# Altium project GBit_Eth.PrjPcb
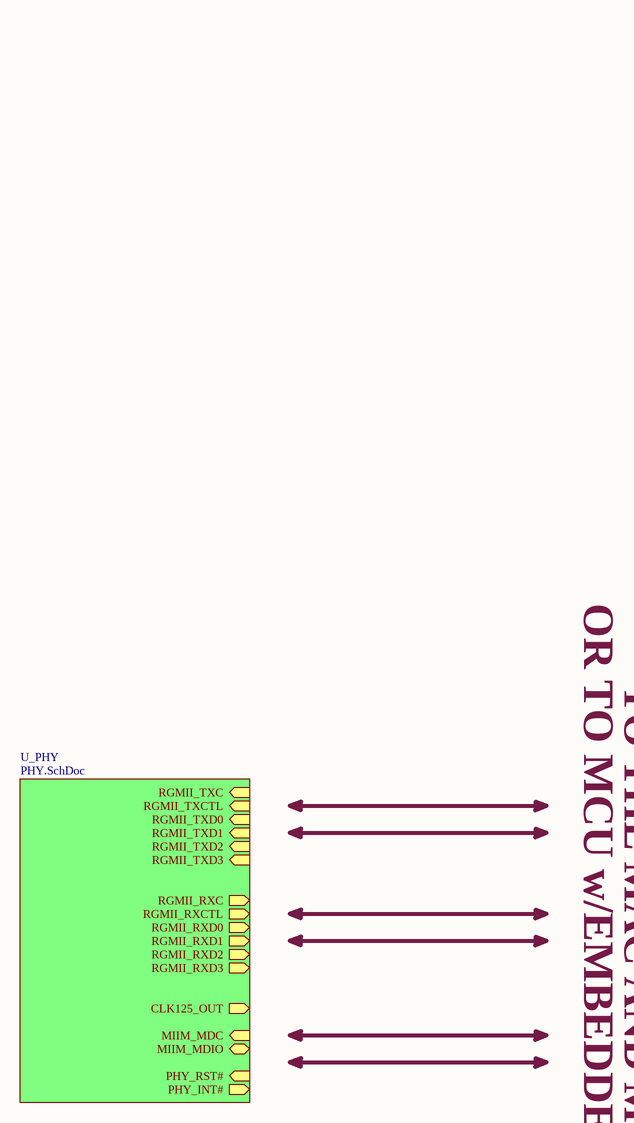
[diagram p0: TOP.SchDoc]
3 sheets, 92 parts. Net scope: hierarchical (ports join the sheet entries above them; power ports are global).
Sheets:
  TOP.SchDoc
    U_PHY = PHY.SchDoc
      U_Magnetics = Magnetics.SchDoc

## Sheet TOP.SchDoc
size A4

### Sub-sheets
U_PHY = PHY.SchDoc: RGMII_RXC (out), RGMII_RXCTL (out), RGMII_RXD0 (out), RGMII_RXD1 (out), RGMII_RXD2 (out), RGMII_RXD3 (out), CLK125_OUT (out), RGMII_TXC (in), RGMII_TXCTL (in), RGMII_TXD0 (in), RGMII_TXD1 (in), RGMII_TXD2 (in), RGMII_TXD3 (in), MIIM_MDC (in), MIIM_MDIO (bidir), PHY_RST# (in), PHY_INT# (out)

### Notes on the sheet
- OR TO MCU w/EMBEDDED MAC
- TO THE MAC AND MCU

## Sheet PHY.SchDoc
size A3
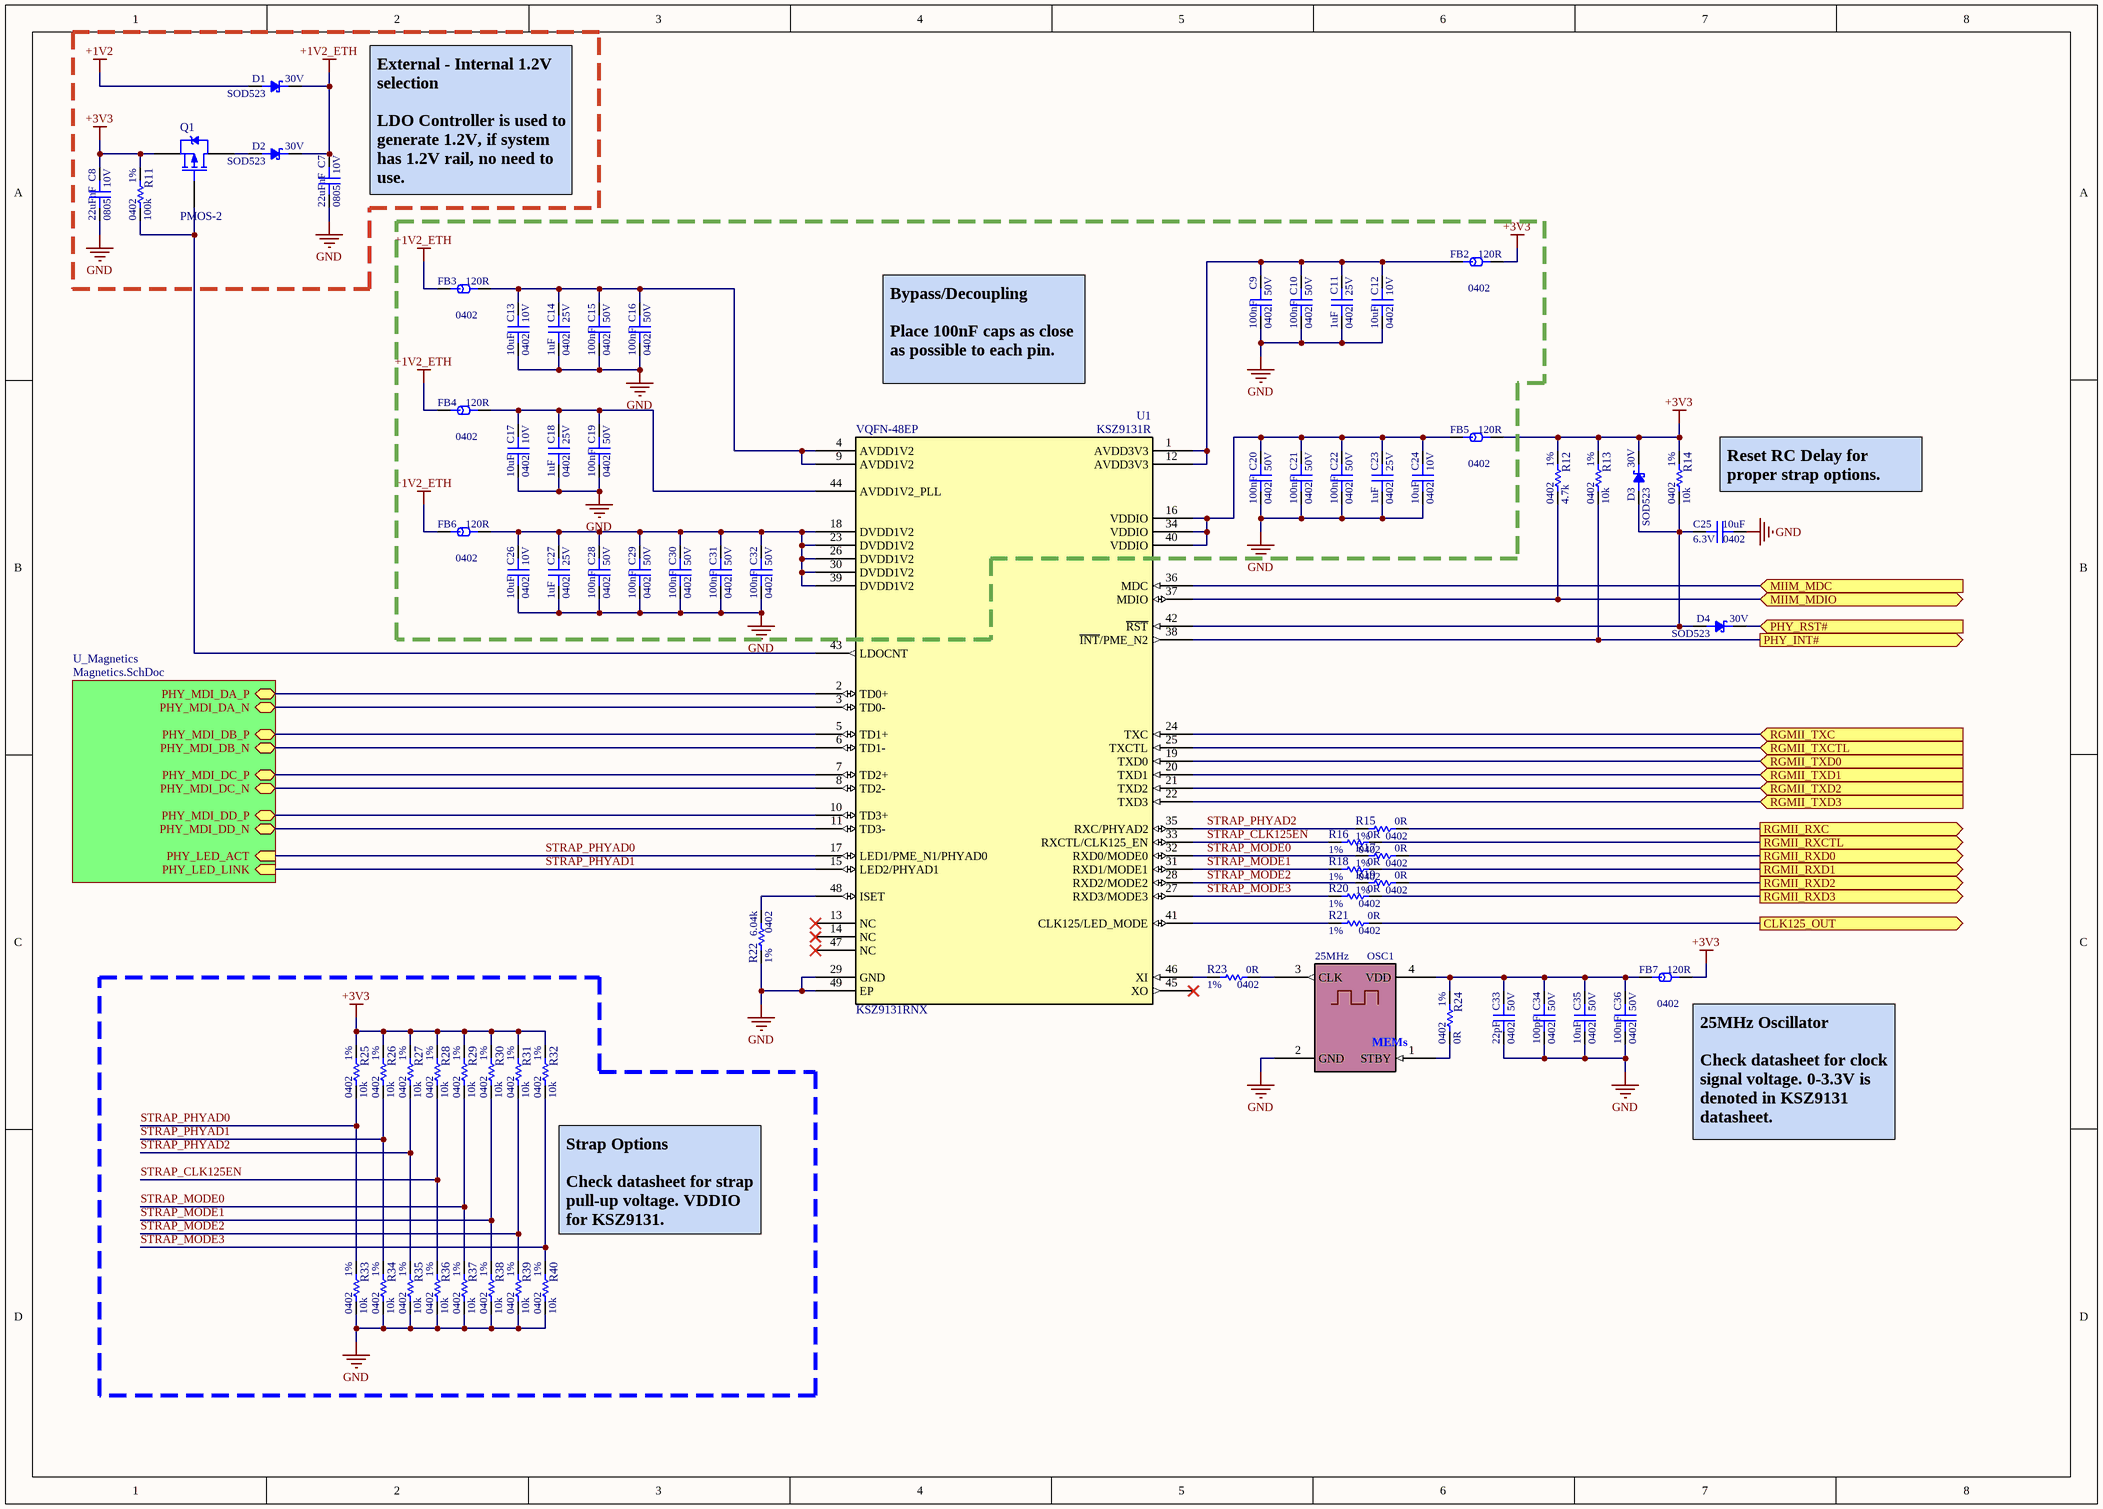
[diagram p1: PHY.SchDoc]

### Parts
C7  value 22uFnF  Voltage: 10V  Package: 0805  [C_0402_GEN_0.70H]  (hidden comment: Capacitor)
C8  value 22uFnF  Voltage: 10V  Package: 0805  [C_0402_GEN_0.70H]  (hidden comment: Capacitor)
C9  value 100nF  Voltage: 50V  Package: 0402  [C_0402_GEN_0.70H]  (hidden comment: Capacitor)
C10  value 100nF  Voltage: 50V  Package: 0402  [C_0402_GEN_0.70H]  (hidden comment: Capacitor)
C11  value 1uF  Voltage: 25V  Package: 0402  [C_0402_GEN_0.70H]  (hidden comment: Capacitor)
C12  value 10uF  Voltage: 10V  Package: 0402  [C_0402_GEN_0.70H]  (hidden comment: Capacitor)
C13  value 10uF  Voltage: 10V  Package: 0402  [C_0402_GEN_0.70H]  (hidden comment: Capacitor)
C14  value 1uF  Voltage: 25V  Package: 0402  [C_0402_GEN_0.70H]  (hidden comment: Capacitor)
C15  value 100nF  Voltage: 50V  Package: 0402  [C_0402_GEN_0.70H]  (hidden comment: Capacitor)
C16  value 100nF  Voltage: 50V  Package: 0402  [C_0402_GEN_0.70H]  (hidden comment: Capacitor)
C17  value 10uF  Voltage: 10V  Package: 0402  [C_0402_GEN_0.70H]  (hidden comment: Capacitor)
C18  value 1uF  Voltage: 25V  Package: 0402  [C_0402_GEN_0.70H]  (hidden comment: Capacitor)
C19  value 100nF  Voltage: 50V  Package: 0402  [C_0402_GEN_0.70H]  (hidden comment: Capacitor)
C20  value 100nF  Voltage: 50V  Package: 0402  [C_0402_GEN_0.70H]  (hidden comment: Capacitor)
C21  value 100nF  Voltage: 50V  Package: 0402  [C_0402_GEN_0.70H]  (hidden comment: Capacitor)
C22  value 100nF  Voltage: 50V  Package: 0402  [C_0402_GEN_0.70H]  (hidden comment: Capacitor)
C23  value 1uF  Voltage: 25V  Package: 0402  [C_0402_GEN_0.70H]  (hidden comment: Capacitor)
C24  value 10uF  Voltage: 10V  Package: 0402  [C_0402_GEN_0.70H]  (hidden comment: Capacitor)
C25  value 10uF  Voltage: 6.3V  Package: 0402  [C_0402_MED-N_0.70H]  (hidden comment: Capacitor)
C26  value 10uF  Voltage: 10V  Package: 0402  [C_0402_GEN_0.70H]  (hidden comment: Capacitor)
C27  value 1uF  Voltage: 25V  Package: 0402  [C_0402_GEN_0.70H]  (hidden comment: Capacitor)
C28  value 100nF  Voltage: 50V  Package: 0402  [C_0402_GEN_0.70H]  (hidden comment: Capacitor)
C29  value 100nF  Voltage: 50V  Package: 0402  [C_0402_GEN_0.70H]  (hidden comment: Capacitor)
C30  value 100nF  Voltage: 50V  Package: 0402  [C_0402_GEN_0.70H]  (hidden comment: Capacitor)
C31  value 100nF  Voltage: 50V  Package: 0402  [C_0402_GEN_0.70H]  (hidden comment: Capacitor)
C32  value 100nF  Voltage: 50V  Package: 0402  [C_0402_GEN_0.70H]  (hidden comment: Capacitor)
C33  value 22pF  Voltage: 50V  Package: 0402  [C_0402_GEN_0.70H]  (hidden comment: Capacitor)
C34  value 100pF  Voltage: 50V  Package: 0402  [C_0402_GEN_0.70H]  (hidden comment: Capacitor)
C35  value 10nF  Voltage: 50V  Package: 0402  [C_0402_GEN_0.70H]  (hidden comment: Capacitor)
C36  value 100nF  Voltage: 50V  Package: 0402  [C_0402_GEN_0.70H]  (hidden comment: Capacitor)
D1  Voltage: 30V  Package: SOD523  [SOD523_RB530SM-30T2R]  (hidden comment: SchDiode_A1C2)
D2  Voltage: 30V  Package: SOD523  [SOD523_RB530SM-30T2R]  (hidden comment: SchDiode_A1C2)
D3  Voltage: 30V  Package: SOD523  [SOD523_RB530SM-30T2R]  (hidden comment: SchDiode_A1C2)
D4  Voltage: 30V  Package: SOD523  [SOD523_RB530SM-30T2R]  (hidden comment: SchDiode_A1C2)
FB2  value 120R  Package: 0402  [FB_0402_GEN_0.55h]  (hidden comment: FerriteBead)
FB3  value 120R  Package: 0402  [FB_0402_GEN_0.55h]  (hidden comment: FerriteBead)
FB4  value 120R  Package: 0402  [FB_0402_GEN_0.55h]  (hidden comment: FerriteBead)
FB5  value 120R  Package: 0402  [FB_0402_GEN_0.55h]  (hidden comment: FerriteBead)
FB6  value 120R  Package: 0402  [FB_0402_GEN_0.55h]  (hidden comment: FerriteBead)
FB7  value 120R  Package: 0402  [FB_0402_GEN_0.55h]  (hidden comment: FerriteBead)
OSC1  value 25MHz  [SMD_3.2X2.5X0.9_ASEMB-25.000MHZ-LY-T]  (hidden comment: Oscillator_4Pin)
Q1  PMOS-2  [TO-220AB]
R11  value 100k  Tolerance: 1%  Package: 0402  [R_0402_GEN_0.40H]  (hidden comment: StandardResistor)
R12  value 4.7k  Tolerance: 1%  Package: 0402  [R_0402_GEN_0.40H]  (hidden comment: StandardResistor)
R13  value 10k  Tolerance: 1%  Package: 0402  [R_0402_GEN_0.40H]  (hidden comment: StandardResistor)
R14  value 10k  Tolerance: 1%  Package: 0402  [R_0402_GEN_0.40H]  (hidden comment: StandardResistor)
R15  value 0R  Tolerance: 1%  Package: 0402  [R_0402_GEN_0.40H]  (hidden comment: StandardResistor)
R16  value 0R  Tolerance: 1%  Package: 0402  [R_0402_GEN_0.40H]  (hidden comment: StandardResistor)
R17  value 0R  Tolerance: 1%  Package: 0402  [R_0402_GEN_0.40H]  (hidden comment: StandardResistor)
R18  value 0R  Tolerance: 1%  Package: 0402  [R_0402_GEN_0.40H]  (hidden comment: StandardResistor)
R19  value 0R  Tolerance: 1%  Package: 0402  [R_0402_GEN_0.40H]  (hidden comment: StandardResistor)
R20  value 0R  Tolerance: 1%  Package: 0402  [R_0402_GEN_0.40H]  (hidden comment: StandardResistor)
R21  value 0R  Tolerance: 1%  Package: 0402  [R_0402_GEN_0.40H]  (hidden comment: StandardResistor)
R22  value 6.04k  Tolerance: 1%  Package: 0402  [R_0402_GEN_0.40H]  (hidden comment: StandardResistor)
R23  value 0R  Tolerance: 1%  Package: 0402  [R_0402_GEN_0.40H]  (hidden comment: StandardResistor)
R24  value 0R  Tolerance: 1%  Package: 0402  [R_0402_GEN_0.40H]  (hidden comment: StandardResistor)
R25  value 10k  Tolerance: 1%  Package: 0402  [R_0402_GEN_0.40H]  (hidden comment: StandardResistor)
R26  value 10k  Tolerance: 1%  Package: 0402  [R_0402_GEN_0.40H]  (hidden comment: StandardResistor)
R27  value 10k  Tolerance: 1%  Package: 0402  [R_0402_GEN_0.40H]  (hidden comment: StandardResistor)
R28  value 10k  Tolerance: 1%  Package: 0402  [R_0402_GEN_0.40H]  (hidden comment: StandardResistor)
R29  value 10k  Tolerance: 1%  Package: 0402  [R_0402_GEN_0.40H]  (hidden comment: StandardResistor)
R30  value 10k  Tolerance: 1%  Package: 0402  [R_0402_GEN_0.40H]  (hidden comment: StandardResistor)
R31  value 10k  Tolerance: 1%  Package: 0402  [R_0402_GEN_0.40H]  (hidden comment: StandardResistor)
R32  value 10k  Tolerance: 1%  Package: 0402  [R_0402_GEN_0.40H]  (hidden comment: StandardResistor)
R33  value 10k  Tolerance: 1%  Package: 0402  [R_0402_GEN_0.40H]  (hidden comment: StandardResistor)
R34  value 10k  Tolerance: 1%  Package: 0402  [R_0402_GEN_0.40H]  (hidden comment: StandardResistor)
R35  value 10k  Tolerance: 1%  Package: 0402  [R_0402_GEN_0.40H]  (hidden comment: StandardResistor)
R36  value 10k  Tolerance: 1%  Package: 0402  [R_0402_GEN_0.40H]  (hidden comment: StandardResistor)
R37  value 10k  Tolerance: 1%  Package: 0402  [R_0402_GEN_0.40H]  (hidden comment: StandardResistor)
R38  value 10k  Tolerance: 1%  Package: 0402  [R_0402_GEN_0.40H]  (hidden comment: StandardResistor)
R39  value 10k  Tolerance: 1%  Package: 0402  [R_0402_GEN_0.40H]  (hidden comment: StandardResistor)
R40  value 10k  Tolerance: 1%  Package: 0402  [R_0402_GEN_0.40H]  (hidden comment: StandardResistor)
U1  KSZ9131RNX  value KSZ9131R  Package: VQFN-48EP

### Sub-sheets
U_Magnetics = Magnetics.SchDoc: PHY_MDI_DA_P (bidir), PHY_MDI_DA_N (bidir), PHY_MDI_DB_P (bidir), PHY_MDI_DB_N (bidir), PHY_MDI_DC_P (bidir), PHY_MDI_DC_N (bidir), PHY_MDI_DD_P (bidir), PHY_MDI_DD_N (bidir), PHY_LED_ACT (in), PHY_LED_LINK (in)

### Ports
CLK125_OUT (out), MIIM_MDC (in), MIIM_MDIO (bidir), PHY_INT# (out), PHY_RST# (in), RGMII_RXC (out), RGMII_RXCTL (out), RGMII_RXD0 (out), RGMII_RXD1 (out), RGMII_RXD2 (out), RGMII_RXD3 (out), RGMII_TXC (in), RGMII_TXCTL (in), RGMII_TXD0 (in), RGMII_TXD1 (in), RGMII_TXD2 (in), RGMII_TXD3 (in)

### Nets
+1V2: D1.1(A)
+1V2_ETH: C7.1 D1.2(C) D2.2(C) FB3.1 FB4.1 FB6.1
+3V3: C8.1 D3.2(C) FB2.2 FB5.2 FB7.2 Q1.3(S) R11.1 R12.1 R13.1 R14.1 R25.1 R26.1 R27.1 R28.1 R29.1 R30.1 R31.1 R32.1
GND: C7.2 C8.2 C9.2 C10.2 C11.2 C12.2 C13.2 C14.2 C15.2 C16.2 C17.2 C18.2 C19.2 C20.2 C21.2 C22.2 C23.2 C24.2 C25.2 C26.2 C27.2 C28.2 C29.2 C30.2 C31.2 C32.2 C33.2 C34.2 C35.2 C36.2 OSC1.2(GND) R22.1 R33.2 R34.2 R35.2 R36.2 R37.2 R38.2 R39.2 R40.2 U1.29(GND) U1.49(EP)
PHY_MDI_DA_N: U1.3(TD0-) ; sheet U_Magnetics/PHY_MDI_DA_N
PHY_MDI_DA_P: U1.2(TD0+) ; sheet U_Magnetics/PHY_MDI_DA_P
PHY_MDI_DB_N: U1.6(TD1-) ; sheet U_Magnetics/PHY_MDI_DB_N
PHY_MDI_DB_P: U1.5(TD1+) ; sheet U_Magnetics/PHY_MDI_DB_P
PHY_MDI_DC_N: U1.8(TD2-) ; sheet U_Magnetics/PHY_MDI_DC_N
PHY_MDI_DC_P: U1.7(TD2+) ; sheet U_Magnetics/PHY_MDI_DC_P
PHY_MDI_DD_N: U1.11(TD3-) ; sheet U_Magnetics/PHY_MDI_DD_N
PHY_MDI_DD_P: U1.10(TD3+) ; sheet U_Magnetics/PHY_MDI_DD_P
STRAP_CLK125EN: R16.1 R28.2 R36.1 U1.33(RXCTL/CLK125_EN)
STRAP_MODE0: R17.1 R29.2 R37.1 U1.32(RXD0/MODE0)
STRAP_MODE1: R18.1 R30.2 R38.1 U1.31(RXD1/MODE1)
STRAP_MODE2: R19.1 R31.2 R39.1 U1.28(RXD2/MODE2)
STRAP_MODE3: R20.1 R32.2 R40.1 U1.27(RXD3/MODE3)
STRAP_PHYAD0: R25.2 R33.1 U1.17(LED1/PME_N1/PHYAD0) ; sheet U_Magnetics/PHY_LED_ACT
STRAP_PHYAD1: R26.2 R34.1 U1.15(LED2/PHYAD1) ; sheet U_Magnetics/PHY_LED_LINK
STRAP_PHYAD2: R15.1 R27.2 R35.1 U1.35(RXC/PHYAD2)
NetC9_1: C9.1 C10.1 C11.1 C12.1 FB2.1 U1.1(AVDD3V3) U1.12(AVDD3V3)
NetC13_1: C13.1 C14.1 C15.1 C16.1 FB3.2 U1.4(AVDD1V2) U1.9(AVDD1V2)
NetC17_1: C17.1 C18.1 C19.1 FB4.2 U1.44(AVDD1V2_PLL)
NetC20_1: C20.1 C21.1 C22.1 C23.1 C24.1 FB5.1 U1.16(VDDIO) U1.34(VDDIO) U1.40(VDDIO)
NetC25_1: C25.1 D3.1(A) D4.1(A) R14.2 U1.42(~{RST})
NetC26_1: C26.1 C27.1 C28.1 C29.1 C30.1 C31.1 C32.1 FB6.2 U1.18(DVDD1V2) U1.23(DVDD1V2) U1.26(DVDD1V2) U1.30(DVDD1V2) U1.39(DVDD1V2)
NetC33_1: C33.1 C34.1 C35.1 C36.1 FB7.1 OSC1.4(VDD) R24.1
NetD2_1: D2.1(A) Q1.2(D)
NetD4_2: D4.2(C) ; port PHY_RST#
NetOSC1_1: OSC1.1(STBY) R24.2
NetOSC1_3: OSC1.3(CLK) R23.2
NetQ1_1: Q1.1(G) R11.2 U1.43(LDOCNT)
NetR12_2: R12.2 U1.37(MDIO) ; port MIIM_MDIO
NetR13_2: R13.2 U1.38(~{INT}/PME_N2) ; port PHY_INT#
NetR15_2: R15.2 ; port RGMII_RXC
NetR16_2: R16.2 ; port RGMII_RXCTL
NetR17_2: R17.2 ; port RGMII_RXD0
NetR18_2: R18.2 ; port RGMII_RXD1
NetR19_2: R19.2 ; port RGMII_RXD2
NetR20_2: R20.2 ; port RGMII_RXD3
NetR21_1: R21.1 U1.41(CLK125/LED_MODE)
NetR21_2: R21.2 ; port CLK125_OUT
NetR22_2: R22.2 U1.48(ISET)
NetR23_1: R23.1 U1.46(XI)
NetU1_19: U1.19(TXD0) ; port RGMII_TXD0
NetU1_20: U1.20(TXD1) ; port RGMII_TXD1
NetU1_21: U1.21(TXD2) ; port RGMII_TXD2
NetU1_22: U1.22(TXD3) ; port RGMII_TXD3
NetU1_24: U1.24(TXC) ; port RGMII_TXC
NetU1_25: U1.25(TXCTL) ; port RGMII_TXCTL
NetU1_36: U1.36(MDC) ; port MIIM_MDC

Not connected (* = marked no-connect by the designer): U1 13(NC)* 14(NC)* 45(XO)* 47(NC)*

### Notes on the sheet
- (near C7) External - Internal 1.2V selection
  LDO Controller is used to generate 1.2V, if system has 1.2V rail, no need to use.
- Bypass/Decoupling
  Place 100nF caps as close as possible to each pin.
- Reset RC Delay for proper strap options.
- (near FB7) 25MHz Oscillator
  Check datasheet for clock signal voltage. 0-3.3V is denoted in KSZ9131 datasheet.
- Strap Options
  Check datasheet for strap pull-up voltage. VDDIO for KSZ9131.
- (in symbol XO_25MHZ_#1) MEMs

### Library data of the parts
C7-C24 C26-C32 C36 = CER_100nF_#5: CAP_CER_100nF_50V_X7R_10%_0402; Tolerance: 10%; Identifier: CER_100nF_#5
C25 = CER_10uF_#7: CAP_CER_10uF_6.3V_X5R_20%_0402; Tolerance: 20%; Identifier: CER_10uF_#7
C33-C35 = CER_10nF_#2: CAP_CER_10nF_50V_X7R_10%_0402; Tolerance: 10%; Identifier: CER_10nF_#2
D1-D4 = SCHO_30V-0.2A_#1: DIO_SCHO_SING_30V_0.2A_SOD523; Value: RB530SM; Tolerance: X; Identifier: SCHO_30V-0.2A_#1
FB2-FB7 = FER_120R@100M_#1: IND_FER_120R@100M_1.3A_25%_0402; Tolerance: ±25%; Voltage: X; Identifier: FER_120R@100M_#1
OSC1 = XO_25MHZ_#1: OSC_XO_25.000MHZ_10PPM_1.8V~3.3V_15pF_CMOS_3.2x2.5x0.9-SMD; Tolerance: ±10ppm; Voltage: 1.8V~3.3V; Package: SMD_3.2x2.5x0.9; Identifier: XO_25MHZ_#1
Q1 = PMOS-2: P-Channel Power MOSFET; Note: Pin 4 not drawn and electrically connected to Pin 2.; Published: 8-Jun-2000; LatestRevisionDate: 17-Jul-2002; LatestRevisionNote: Re-released for DXP Platform.; DatasheetVersion: PD-9.390D; PackageVersion: Feb-1997; PackageReference: TO-220AB; Publisher: Altium Limited; PackageDescription: TO, Thru-Hole, Vertical, Heatsink Mounted; 3 In-Line Leads; Pitch 2.54 mm
R11-R40 = STD_100R_#1: RES_STD_100R_0.063W_1%_100ppm_0402; Voltage: 50V; Identifier: STD_100R_#1
U1 = KSZ9131RNX: GBit Eth Phy w/RGMII Interface; Voltage: voltage

## Sheet Magnetics.SchDoc
size A3
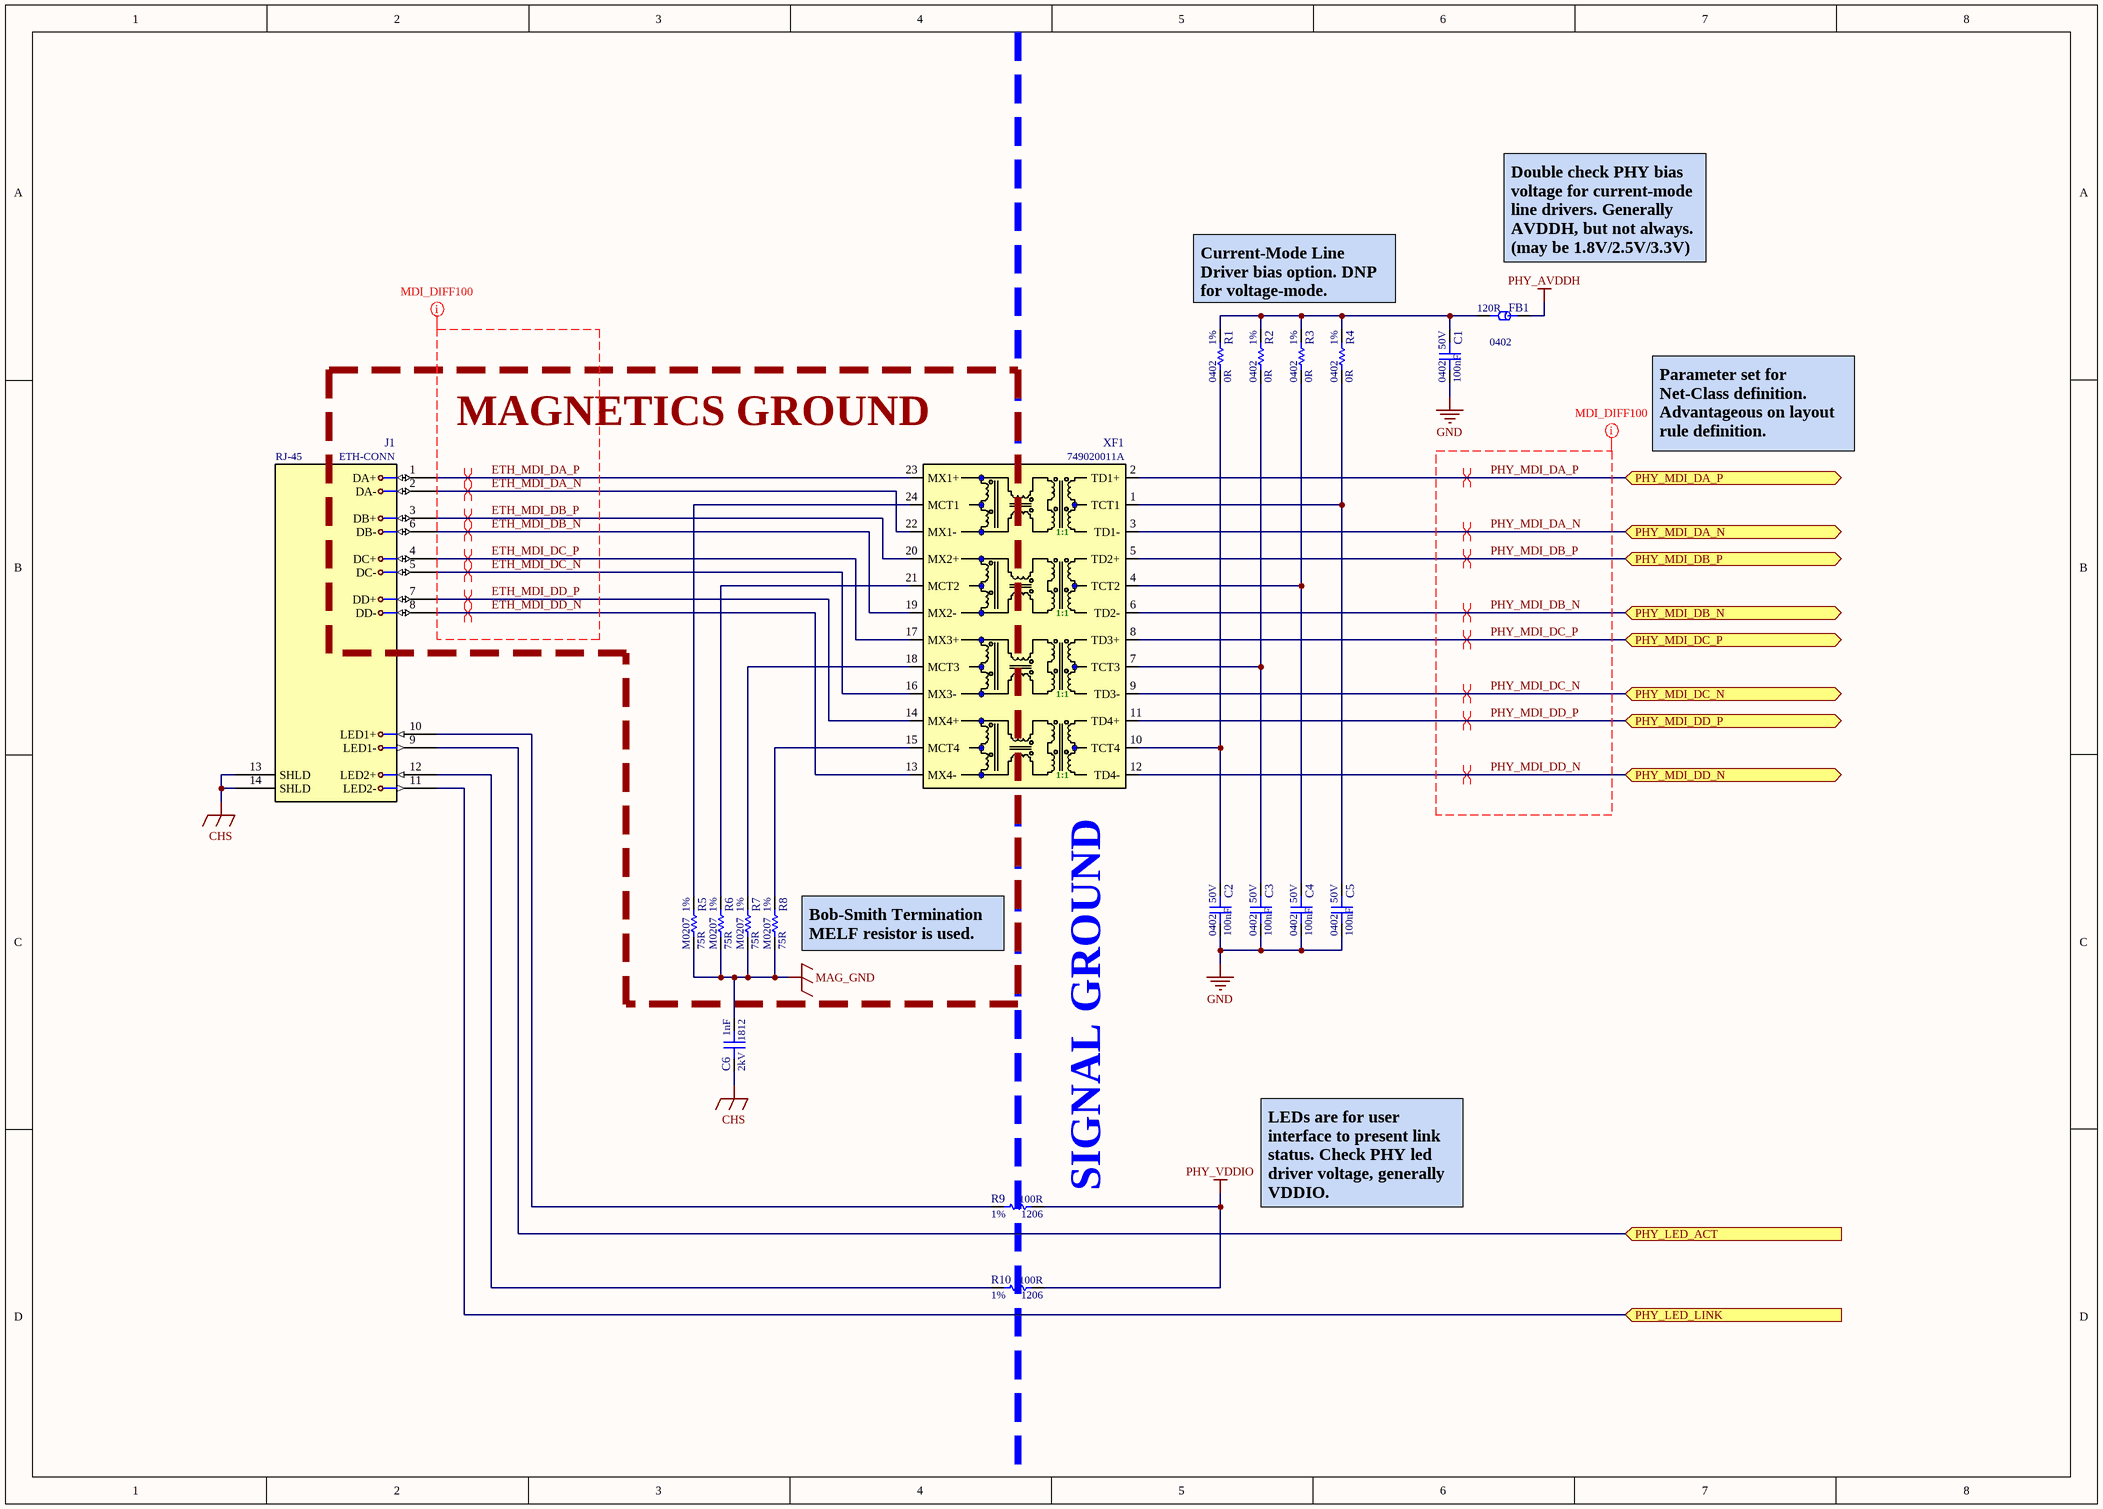
[diagram p2: Magnetics.SchDoc]

### Parts
C1  value 100nF  Voltage: 50V  Package: 0402  [C_0402_GEN_0.70H]  (hidden comment: Capacitor)
C2  value 100nF  Voltage: 50V  Package: 0402  [C_0402_GEN_0.70H]  (hidden comment: Capacitor)
C3  value 100nF  Voltage: 50V  Package: 0402  [C_0402_GEN_0.70H]  (hidden comment: Capacitor)
C4  value 100nF  Voltage: 50V  Package: 0402  [C_0402_GEN_0.70H]  (hidden comment: Capacitor)
C5  value 100nF  Voltage: 50V  Package: 0402  [C_0402_GEN_0.70H]  (hidden comment: Capacitor)
C6  value 1nF  Voltage: 2kV  Package: 1812  [C_1812_MED-N_1.55H]  (hidden comment: Capacitor)
FB1  value 120R  Package: 0402  [FB_0402_GEN_0.55h]  (hidden comment: FerriteBead)
J1  value ETH-CONN  Package: RJ-45  (hidden comment: B2C_ETH_JACK_#2)
R1  value 0R  Tolerance: 1%  Package: 0402  [R_0402_GEN_0.40H]  (hidden comment: StandardResistor)
R2  value 0R  Tolerance: 1%  Package: 0402  [R_0402_GEN_0.40H]  (hidden comment: StandardResistor)
R3  value 0R  Tolerance: 1%  Package: 0402  [R_0402_GEN_0.40H]  (hidden comment: StandardResistor)
R4  value 0R  Tolerance: 1%  Package: 0402  [R_0402_GEN_0.40H]  (hidden comment: StandardResistor)
R5  value 75R  Tolerance: 1%  Package: M0207  [MELF_0207_GEN_2.4H]  (hidden comment: StandardResistor)
R6  value 75R  Tolerance: 1%  Package: M0207  [MELF_0207_GEN_2.4H]  (hidden comment: StandardResistor)
R7  value 75R  Tolerance: 1%  Package: M0207  [MELF_0207_GEN_2.4H]  (hidden comment: StandardResistor)
R8  value 75R  Tolerance: 1%  Package: M0207  [MELF_0207_GEN_2.4H]  (hidden comment: StandardResistor)
R9  value 100R  Tolerance: 1%  Package: 1206  [R_0402_GEN_0.40H]  (hidden comment: StandardResistor)
R10  value 100R  Tolerance: 1%  Package: 1206  [R_0402_GEN_0.40H]  (hidden comment: StandardResistor)
XF1  value 749020011A  (hidden comment: GigEthXformer)

### Blocks framed on the sheet
MAGNETICS GROUND: J1 R5-R8

### Ports
PHY_LED_ACT (in), PHY_LED_LINK (in), PHY_MDI_DA_N (bidir), PHY_MDI_DA_P (bidir), PHY_MDI_DB_N (bidir), PHY_MDI_DB_P (bidir), PHY_MDI_DC_N (bidir), PHY_MDI_DC_P (bidir), PHY_MDI_DD_N (bidir), PHY_MDI_DD_P (bidir)

### Nets
CHS: C6.1 J1.13(SHLD) J1.14(SHLD)
GND: C1.2 C2.2 C3.2 C4.2 C5.2
MAG_GND: C6.2 R5.2 R6.2 R7.2 R8.2
PHY_AVDDH: FB1.1
PHY_VDDIO: R9.2 R10.2
ETH_MDI_DA_N: J1.2(DA-) XF1.22(MX1-)
ETH_MDI_DA_P: J1.1(DA+) XF1.23(MX1+)
ETH_MDI_DB_N: J1.6(DB-) XF1.19(MX2-)
ETH_MDI_DB_P: J1.3(DB+) XF1.20(MX2+)
ETH_MDI_DC_N: J1.5(DC-) XF1.16(MX3-)
ETH_MDI_DC_P: J1.4(DC+) XF1.17(MX3+)
ETH_MDI_DD_N: J1.8(DD-) XF1.13(MX4-)
ETH_MDI_DD_P: J1.7(DD+) XF1.14(MX4+)
PHY_MDI_DA_N: XF1.3(TD1-) ; port PHY_MDI_DA_N
PHY_MDI_DA_P: XF1.2(TD1+) ; port PHY_MDI_DA_P
PHY_MDI_DB_N: XF1.6(TD2-) ; port PHY_MDI_DB_N
PHY_MDI_DB_P: XF1.5(TD2+) ; port PHY_MDI_DB_P
PHY_MDI_DC_N: XF1.9(TD3-) ; port PHY_MDI_DC_N
PHY_MDI_DC_P: XF1.8(TD3+) ; port PHY_MDI_DC_P
PHY_MDI_DD_N: XF1.12(TD4-) ; port PHY_MDI_DD_N
PHY_MDI_DD_P: XF1.11(TD4+) ; port PHY_MDI_DD_P
STRAP_PHYAD0: J1.9(LED1-) ; port PHY_LED_ACT
STRAP_PHYAD1: J1.11(LED2-) ; port PHY_LED_LINK
NetC1_1: C1.1 FB1.2 R1.1 R2.1 R3.1 R4.1
NetC2_1: C2.1 R1.2 XF1.10(TCT4)
NetC3_1: C3.1 R2.2 XF1.7(TCT3)
NetC4_1: C4.1 R3.2 XF1.4(TCT2)
NetC5_1: C5.1 R4.2 XF1.1(TCT1)
NetJ1_10: J1.10(LED1+) R9.1
NetJ1_12: J1.12(LED2+) R10.1
NetR5_1: R5.1 XF1.24(MCT1)
NetR6_1: R6.1 XF1.21(MCT2)
NetR7_1: R7.1 XF1.18(MCT3)
NetR8_1: R8.1 XF1.15(MCT4)

### Layout directives
differential pair: ETH_MDI_DA_N, ETH_MDI_DA_P, ETH_MDI_DB_N, ETH_MDI_DB_P, ETH_MDI_DC_N, ETH_MDI_DC_P, ETH_MDI_DD_N, ETH_MDI_DD_P, PHY_MDI_DA_N, PHY_MDI_DA_P, PHY_MDI_DB_N, PHY_MDI_DB_P, PHY_MDI_DC_N, PHY_MDI_DC_P, PHY_MDI_DD_N, PHY_MDI_DD_P
net class MDI_DIF100: ETH_MDI_DA_N, ETH_MDI_DA_P, ETH_MDI_DB_N, ETH_MDI_DB_P, ETH_MDI_DC_N, ETH_MDI_DC_P, ETH_MDI_DD_N, ETH_MDI_DD_P, PHY_MDI_DA_N, PHY_MDI_DA_P, PHY_MDI_DB_N, PHY_MDI_DB_P, PHY_MDI_DC_N, PHY_MDI_DC_P, PHY_MDI_DD_N, PHY_MDI_DD_P

### Notes on the sheet
- Current-Mode Line Driver bias option. DNP for voltage-mode.
- Double check PHY bias voltage for current-mode line drivers. Generally AVDDH, but not always. (may be 1.8V/2.5V/3.3V)
- Parameter set for Net-Class definition. Advantageous on layout rule definition.
- (near R8) Bob-Smith Termination
  MELF resistor is used.
- SIGNAL GROUND
- LEDs are for user interface to present link status. Check PHY led driver voltage, generally VDDIO.
- (in symbol GigEthXformer) 1:1

### Library data of the parts
C1-C5 = CER_100nF_#5: as C7 on sheet PHY; Identifier: CER_100nF_#5
C6 = CER_1nF_#4: CAP_CER_1nF_2KV_X7R_10%_1812; Tolerance: 10%; Identifier: CER_1nF_#4
FB1 = FER_120R@100M: IND_FER_120R@100M_1.3A_25%_0402; Tolerance: ±25%; Voltage: X; Identifier: FER_120R@100M
R1-R4 R9 R10 = STD_100R_#1: as R11 on sheet PHY; Identifier: STD_100R_#1
R5-R8 = STD_75R_#1: RES_STD_75R_1W_1%_50ppm_MELF-0207; Voltage: 350V; Identifier: STD_75R_#1
XF1 = GigEthXformer: Gigabit Ethernet xformer; Package: SMD

## Nets that join several sheets
GND: PHY (42 pins), Magnetics (5 pins)
PHY_MDI_DA_N: PHY (U1.3), Magnetics (XF1.3)
PHY_MDI_DA_P: PHY (U1.2), Magnetics (XF1.2)
PHY_MDI_DB_N: PHY (U1.6), Magnetics (XF1.6)
PHY_MDI_DB_P: PHY (U1.5), Magnetics (XF1.5)
PHY_MDI_DC_N: PHY (U1.8), Magnetics (XF1.9)
PHY_MDI_DC_P: PHY (U1.7), Magnetics (XF1.8)
PHY_MDI_DD_N: PHY (U1.11), Magnetics (XF1.12)
PHY_MDI_DD_P: PHY (U1.10), Magnetics (XF1.11)
STRAP_PHYAD0: PHY (R25.2 R33.1 U1.17), Magnetics (J1.9)
STRAP_PHYAD1: PHY (R26.2 R34.1 U1.15), Magnetics (J1.11)